# Altium schematic sheet ESP32.SchDoc
size A
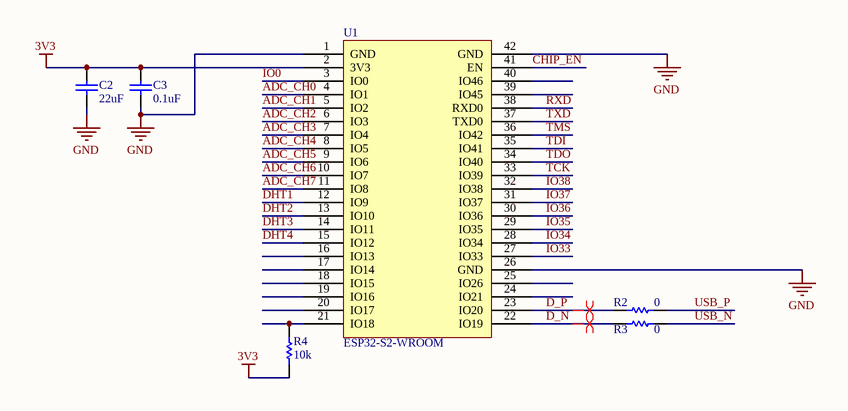
[diagram p0: ESP32.SchDoc]

## Parts
C2  22uF  [C0805]
C3  0.1uF  [0402C]
R2  0  [PCB-azzhouwj1h0sqqpj65ny-1]
R3  0  [PCB-azzhouwj1h0sqqpj65ny-1]
R4  10k  [PCB-urbe6pl2f36u5sj9z9e0-1]
U1  ESP32-S2-WROOM  [PCBComponent_1]

## Nets
3V3: C2.2 C3.1 R4.2 U1.2(3V3)
GND: C2.1 C3.2 U1.1(GND) U1.26(GND) U1.42(GND)
ADC_CH0: U1.4(IO1)
ADC_CH1: U1.5(IO2)
ADC_CH2: U1.6(IO3)
ADC_CH3: U1.7(IO4)
ADC_CH4: U1.8(IO5)
ADC_CH5: U1.9(IO6)
ADC_CH6: U1.10(IO7)
ADC_CH7: U1.11(IO8)
CHIP_EN: U1.41(EN)
D_N: R3.1 U1.22(IO19)
D_P: R2.1 U1.23(IO20)
DHT1: U1.12(IO9)
DHT2: U1.13(IO10)
DHT3: U1.14(IO11)
DHT4: U1.15(IO12)
IO0: U1.3(IO0)
IO33: U1.27(IO33)
IO34: U1.28(IO34)
IO35: U1.29(IO35)
IO36: U1.30(IO36)
IO37: U1.31(IO37)
IO38: U1.32(IO38)
RXD: U1.38(RXD0)
TCK: U1.33(IO39)
TDI: U1.35(IO41)
TDO: U1.34(IO40)
TMS: U1.36(IO42)
TXD: U1.37(TXD0)
USB_N: R3.2
USB_P: R2.2
NetR4_1: R4.1 U1.21(IO18)

Not connected (* = marked no-connect by the designer): U1 16(IO13) 17(IO14) 18(IO15) 19(IO16) 20(IO17) 24(IO21) 25(IO26) 39(IO45) 40(IO46)

## Layout directives
differential pair: D_N, D_P

## Library data of the parts
C2 = CMP-3afbf396deb1e53c-2: LMK212BJ226MG-T TAIYO YU DEN CERAMIC CAPACITOR 22U F 20% 10V X5R 0805 RoHS; Voltage Rating (DC): 10.0 V; Lifecycle Status: Not Listed by Manufacturer; Number of Pins: 2; Case/Package: 0805, 2012; Mounting Style: Surface Mount; Octopart URL: http://octopart.com/lmk212bj226mg-t-taiyo+yuden-6799660; OctopartID: 3afbf396deb1e53c; Capacitance Tolerance: ±20%; Dielectric Characteristic: X5R
C3 = CMP-19299680-6: 0402 0.1 uF 10 V ±10 % Tolerance X5R Surface Mount Multilayer Ceramic Capacitor; Manufacturer Part Number: GRM155R61A104KA01D; Voltage Rating (DC): 10.0 V; Lead-Free Status: Lead Free; Capacitance Tolerance: ±10%; Capacitance: 100 nF; Dielectric Characteristic: X5R; Number of Pins: 2; Size-Length: 1.00 mm; RoHS: Compliant; Size-Height: 500 µm; Octopart Url: http://octopart.com/grm155r61a104ka01d-murata-196036; Seller Landing  Url: https://octopart-clicks.com/click/track?country=US&ak=8157f166&sig=0ce8b58&sid=1106&ppid=196036&vpid=21326200&ct=offers; Case/Package: 0402; Size-Thickness: 500 µm; OctopartID: 87004e085fa258c7; Lifecycle Status: Active; REACH SVHC Compliance: No SVHC; Size-Width: 500 µm; Packaging: Cut Tape (CT); Mounting Style: Surface Mount
R2 R3 = CMP-13527731-11: RC Series 0402 0.063 W 0 Ohms Jumper Surface Mount Thick Film Chip Resistor; Temperature Coefficient: -250 ppm/°C to 250 ppm/°C; RoHS: Compliant; Packaging: Tape & Reel; Number of Pins: 2; Size-Width: 500 µm; OctopartID: 3abff0f8c341e578
R4 = CMP-1974d512ef63c6b3-1: Res, AEC-Q200, Thick Film, 10K, 5%, 0603; Manufacturer Part Number: CRGCQ0603J10K; Packaging: Cut Tape (CT); Resistance Tolerance: ±5%; Lifecycle Status: Not Listed by Manufacturer; OctopartID: 1974d512ef63c6b3; Octopart URL: https://octopart.com/crgcq0603j10k-te+connectivity-91018097
U1 = CMP-dacd15a1cbe3050a-2: SMD Module ESP32-S2-WROOM; Octopart URL: https://octopart.com/esp32-s2-wroom-espressif+systems-107361352